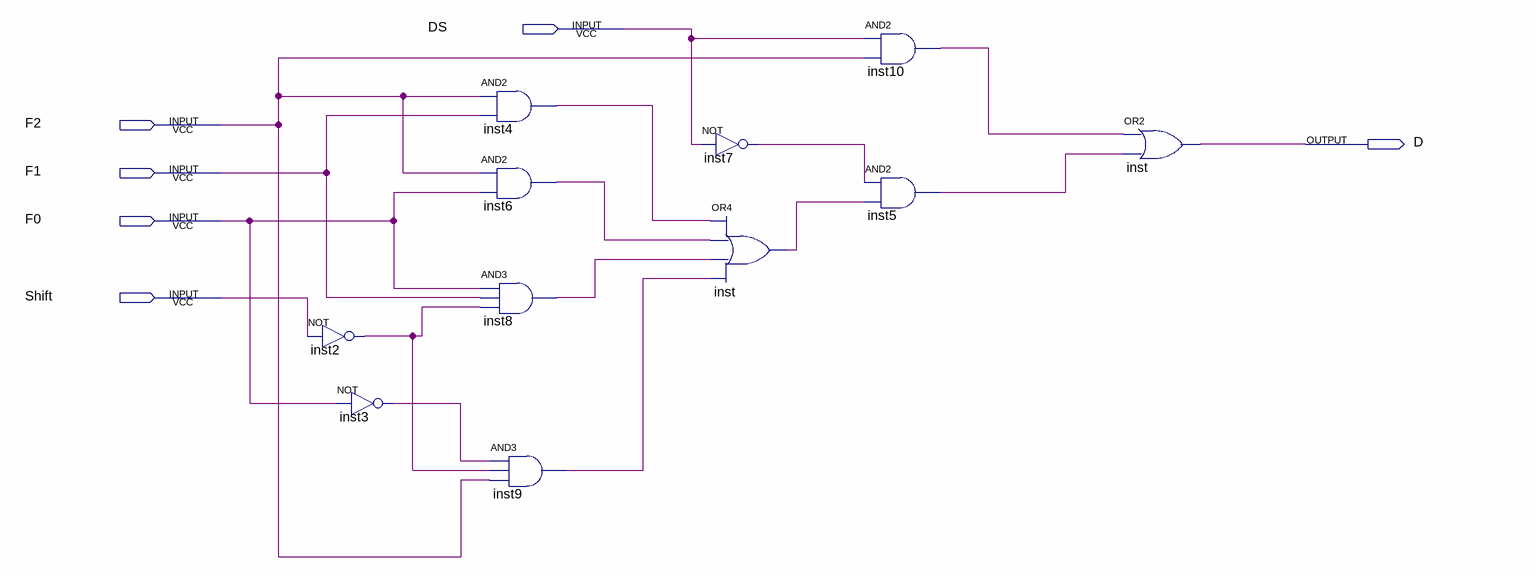
[diagram p0: schematic sheet]
// Quartus schematic entradaFFh2.bdf as structural Verilog: 11 symbols, 6 pins
module entradaFFh2 (
  input  DS,
  input  F2,
  input  F1,
  input  F0,
  input  Shift,
  output D
);

  wire inst2_out, inst3_out, inst4_out, inst5_out, inst6_out, inst7_out, inst8_out, inst9_out, inst10_out,
       inst_out;

  not inst2 (inst2_out, Shift);
  not inst3 (inst3_out, F0);
  and inst4 (inst4_out, F2, F1);
  and inst6 (inst6_out, F2, F0);
  and inst8 (inst8_out, F0, F1, inst2_out);
  and inst9 (inst9_out, inst3_out, inst2_out, F2);
  not inst7 (inst7_out, DS);
  or inst (inst_out, inst4_out, inst6_out, inst8_out, inst9_out);
  and inst10 (inst10_out, DS, F2);
  and inst5 (inst5_out, inst7_out, inst_out);
  or inst_dup2 (D, inst10_out, inst5_out);
endmodule
